# Altium schematic sheet SWD resistor hack.SchDoc
size A4
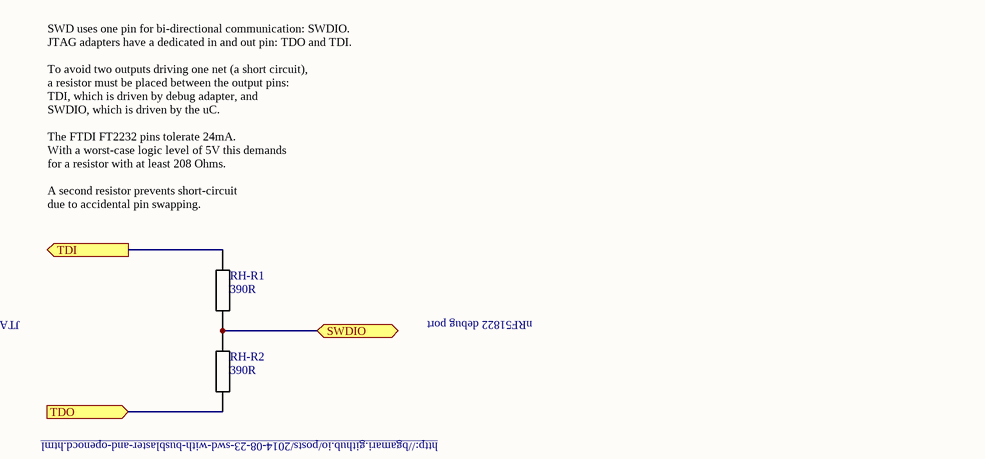
[diagram p0: SWD resistor hack.SchDoc]

## Parts
RH-R1  390R  [R 0805 / 2012 wide]
RH-R2  390R  [R 0805 / 2012 wide]

## Ports
SWDIO, TDI (out), TDO (in)

## Nets
SWDIO: RH-R1.1 RH-R2.2 ; port SWDIO
TDI: RH-R1.2 ; port TDI
TDO: RH-R2.1 ; port TDO

## Notes on the sheet
- (near RH-R1) SWD uses one pin for bi-directional communication: SWDIO.
  JTAG adapters have a dedicated in and out pin: TDO and TDI.
  To avoid two outputs driving one net (a short circuit),
  a resistor must be placed between the output pins:
  TDI, which is driven by debug adapter, and
  SWDIO, which is driven by the uC.
  The FTDI FT2232 pins tolerate 24mA.
  With a worst-case logic level of 5V this demands
  for a resistor with at least 208 Ohms.
  A second resistor prevents short-circuit
  due to accidental pin swapping.
- JTAG/SWD debug adapter
- nRF51822 debug port
- (near RH-R2) http://bgamari.github.io/posts/2014-08-23-swd-with-busblaster-and-openocd.html

## Library data of the parts
RH-R1 RH-R2 = Resistor